# EAGLE design power supply bot (EAGLE 9.6.2)
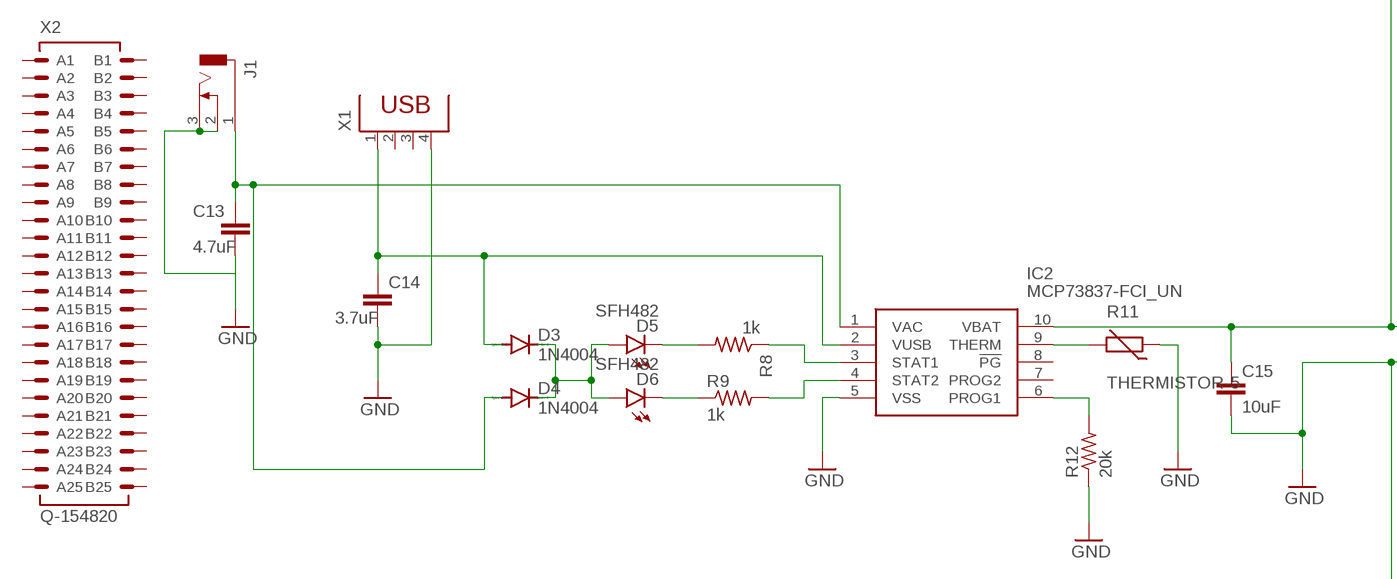
[diagram p0: schematic, sheet 1, part 1 of 2]
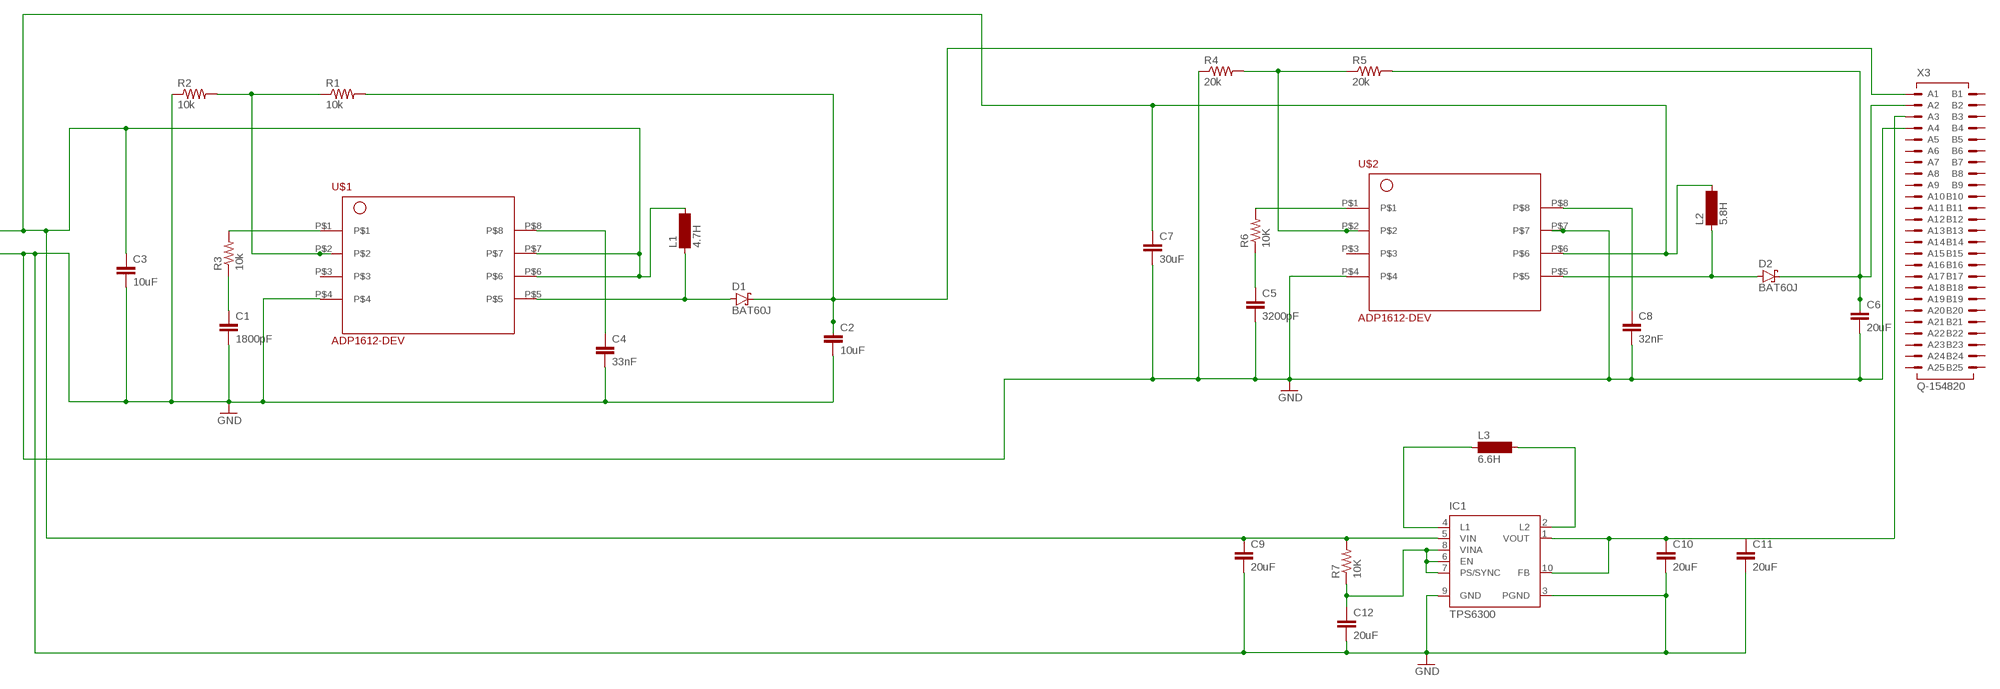
[diagram p1: schematic, sheet 1, part 2 of 2]

## Parts
C1  1800pF  C2.5/4  [C2.5-4]
C2  10uF  C2.5/4  [C2.5-4]
C3  10uF  C2.5/4  [C2.5-4]
C4  33nF  C2.5/4  [C2.5-4]
C5  3200pF  C2.5/4  [C2.5-4]
C6  20uF  C2.5/4  [C2.5-4]
C7  30uF  C2.5/4  [C2.5-4]
C8  32nF  C2.5/4  [C2.5-4]
C9  20uF  C2,5-3  [C2.5-3]
C10  20uF  C2,5-3  [C2.5-3]
C11  20uF  C2,5-3  [C2.5-3]
C12  20uF  C2,5-3  [C2.5-3]
C13  4.7uF  C2,5-3  [C2.5-3]
C14  3.7uF  C2,5-3  [C2.5-3]
C15  10uF  C2,5-3  [C2.5-3]
D1  BAT60J  [SOD323_ST]
D2  BAT60J  [SOD323_ST]
D3  1N4004  [DO41-10]
D4  1N4004  [DO41-10]
D5  SFH482  [SFH482]
D6  SFH482  [SFH482]
IC1  TPS6300  [DRC-S-PVSON-N10]
IC2  MCP73837-FCI_UN  [SOP50P490X110-10N]
J1  DCJ0303  [DCJ0303]
L1  4.7H  BS11  [BS11]
L2  5.8H  BS11  [BS11]
L3  6.6H  BS75  [BS75]
R1  10k  R-US_0204/7  [0204/7]
R2  10k  R-US_0204/7  [0204/7]
R3  10k  R-US_0204/7  [0204/7]
R4  20k  R-US_0204/7  [0204/7]
R5  20k  R-US_0204/7  [0204/7]
R6  10K  R-US_0204/7  [0204/7]
R7  10K  R-US_0204/5  [0204/5]
R8  1k  R-US_0204/5  [0204/5]
R9  1k  R-US_0204/5  [0204/5]
R11  THERMISTOR-5  [R-5]
R12  20k  R-US_0204/5  [0204/5]
U$1  ADP1612-DEV  [TQFP-ADP1612]
U$2  ADP1612-DEV  [TQFP-ADP1612]
X1  PN61729  [PN61729]
X2  Q-154820  [154820]
X3  Q-154820  [154820]

## Nets
GND: C1.2 C2.2 C3.2 C4.2 C5.2 C6.2 C7.2 C8.2 C9.2 C10.2 C11.2 C12.2 C13.2 C14.1 C14.2 C15.2 D3.A IC1.3(PGND) IC1.9(GND) IC2.2(VUSB) IC2.5(VSS) J1.2 J1.3 R2.1 R4.1 R11.1 R12.1 U$1.P$4 U$2.P$4 U$2.P$7 X1.1 X1.4 X3.A4
N$1: R3.2 U$1.P$1
N$2: C1.1 R3.1
N$3: R1.1 R2.2 U$1.P$2
N$4: C2.1 D1.C R1.2 X3.A1
N$5: D1.A L1.1 U$1.P$5
N$6: C4.1 U$1.P$8
N$8: C3.1 C7.1 C9.1 C15.1 IC1.5(VIN) IC2.10(VBAT) L1.2 L2.2 R7.2 U$1.P$6 U$1.P$7 U$2.P$6
N$9: R6.2 U$2.P$1
N$10: C5.1 R6.1
N$11: R4.2 R5.1 U$2.P$2
N$12: C6.1 D2.C R5.2 X3.A2
N$13: C8.1 U$2.P$8
N$14: D2.A L2.1 U$2.P$5
N$16: IC1.4(L1) L3.1
N$17: IC1.2(L2) L3.2
N$18: C10.1 C11.1 IC1.1(VOUT) IC1.10(FB) X3.A3
N$19: IC2.9(THERM) R11.2
N$20: C12.1 IC1.6(EN) IC1.7(PS/SYNC) IC1.8(VINA) R7.1
N$21: IC2.6(PROG1) R12.2
N$22: D5.K(C) R8.2
N$23: D6.K(C) R9.1
N$24: C13.1 D4.A IC2.1(VAC) J1.1
N$25: IC2.3(STAT1) R8.1
N$26: IC2.4(STAT2) R9.2
N$28: D3.C D4.C D5.A D6.A
Unconnected: IC1.TH IC2.7(PROG2) IC2.8(!PG) U$1.P$3 U$2.P$3 X1.2 X1.3 X2.A1 X2.A2 X2.A3 X2.A4 X2.A5 X2.A6 X2.A7 X2.A8 X2.A9 X2.A10 X2.A11 X2.A12 X2.A13 X2.A14 X2.A15 X2.A16 X2.A17 X2.A18 X2.A19 X2.A20 X2.A21 X2.A22 X2.A23 X2.A24 X2.A25 X2.B1 X2.B2 X2.B3 X2.B4 X2.B5 X2.B6 X2.B7 X2.B8 X2.B9 X2.B10 X2.B11 X2.B12 X2.B13 X2.B14 X2.B15 X2.B16 X2.B17 X2.B18 X2.B19 X2.B20 X2.B21 X2.B22 X2.B23 X2.B24 X2.B25 X3.A5 X3.A6 X3.A7 X3.A8 X3.A9 X3.A10 X3.A11 X3.A12 X3.A13 X3.A14 X3.A15 X3.A16 X3.A17 X3.A18 X3.A19 X3.A20 X3.A21 X3.A22 X3.A23 X3.A24 X3.A25 X3.B1 X3.B2 X3.B3 X3.B4 X3.B5 X3.B6 X3.B7 X3.B8 X3.B9 X3.B10 X3.B11 X3.B12 X3.B13 X3.B14 X3.B15 X3.B16 X3.B17 X3.B18 X3.B19 X3.B20 X3.B21 X3.B22 X3.B23 X3.B24 X3.B25

## Library data of the parts
C1-C15 = capacitor-wima:C: CAPACITOR naming: grid - package width
D1 D2 = diode:BAT60J: Schottky barrier diode Source: www.st.com, BAT60J.pdf
D3 D4 = diode:1N4004: DIODE general purpose rectifier, 1 A
D5 D6 = led:SFH482: IR LED infrared emitting diode, Infineon
IC1 = texas:TPS6300*: HIGH EFFICIENT SINGLE INDUCTOR BUCK-BOOST CONVERTER WITH 1.8-A SWITCHES Source: http://focus.ti.com/lit/ds/symlink/tps63001.pdf; MPN: TPS63000DRCTG4; OC_FARNELL: 1511852; OC_NEWARK: 59M7217
IC2 = MCP73837-FCI_UN:MCP73837-FCI_UN: Li-Ion Charger USB/DC 4.2V 1A PG MSOP10 Source: Datasheet <http://ww1.microchip.com/downloads/en/DeviceDoc/22071B.pdf>; ARROW_PART_NUMBER: MCP73837-FCI/UN; ARROW_PRICE-STOCK: https://www.arrow.com/en/products/mcp73837-fciun/microchip-technology; DESCRIPTION: Li-Ion Charger USB/DC 4.2V 1A PG MSOP10; HEIGHT: 1.1mm; MANUFACTURER_NAME: Microchip; MANUFACTURER_PART_NUMBER: MCP73837-FCI/UN; MOUSER_PART_NUMBER: 579-MCP73837-FCI/UN; MOUSER_PRICE-STOCK: https://www.mouser.co.uk/ProductDetail/Microchip-Technology/MCP73837-FCI-UN?qs=hH%252BOa0VZEiDKGj395FRsiw%3D%3D
J1 = con-jack:DCJ0303: DC POWER JACK Source: DCJ0303.pdf; OC_FARNELL: unknown; OC_NEWARK: unknown
L1-L3 = inductor-neosid:BS: INDUCTOR nominal inductance, magnetically screened; OC_FARNELL: unknown; OC_NEWARK: unknown
R1-R9 R12 = rcl:R-US_: RESISTOR, American symbol; SPICEPREFIX: R
R11 = varistor:THERMISTOR: THERMISTOR
U$1 U$2 = ADP1612:ADP1612-DEV
X1 = con-berg:PN61729: BERG USB connector; OC_FARNELL: unknown; OC_NEWARK: unknown
X2 X3 = con-erni:Q-154820: Male Connector SMC-Q 50 contacts Type 7-13 - Low Profile Source: http://www.erni.com/DB/PDF-Drawing/SMC/154820.pdf; OC_FARNELL: unknown; OC_NEWARK: unknown

## Board
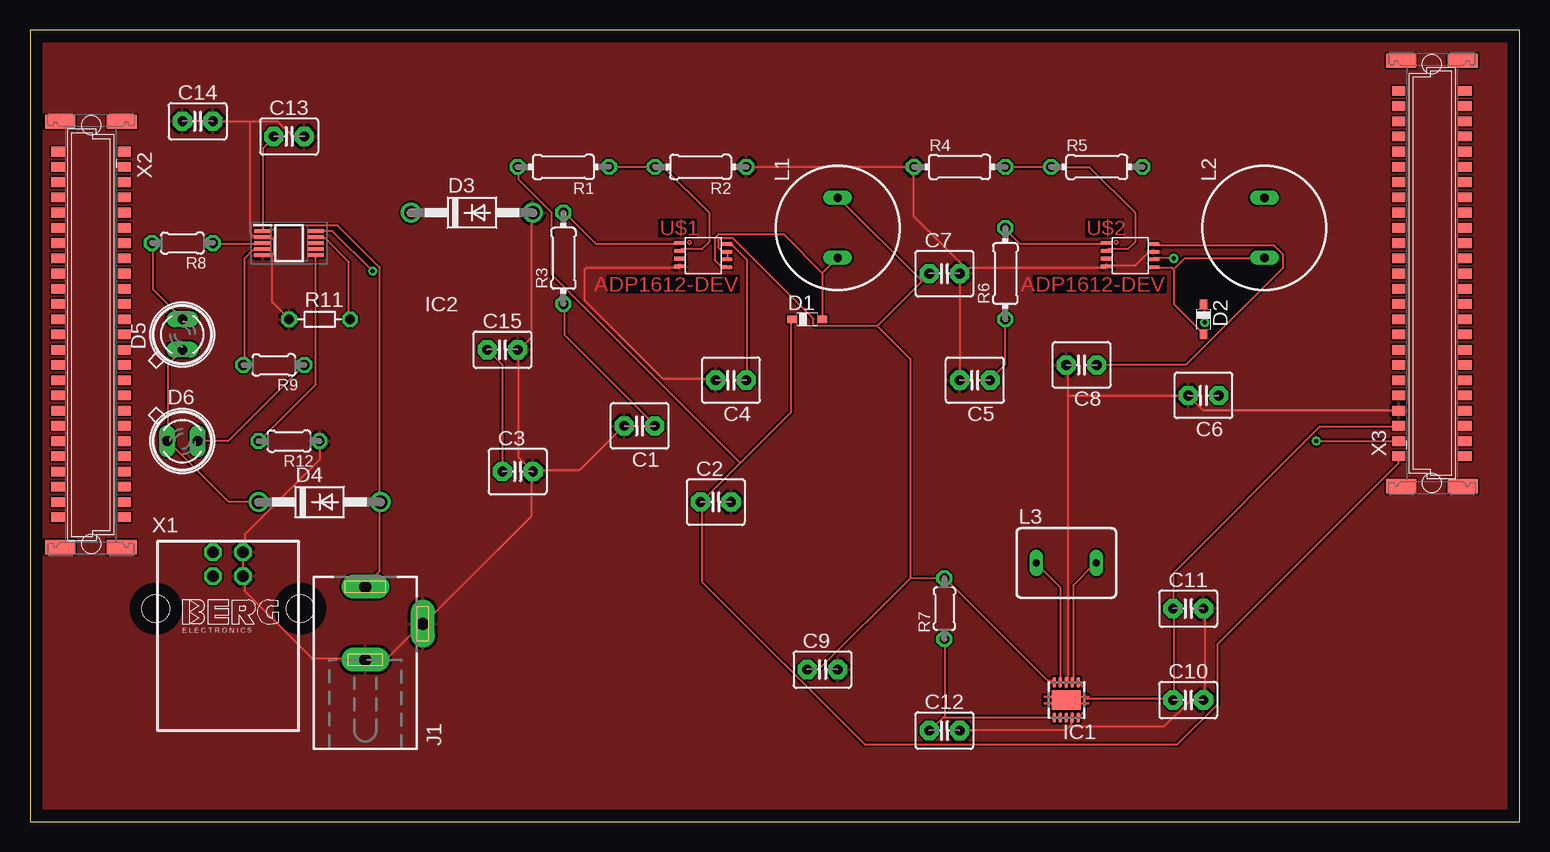
[diagram p2: board, top side]
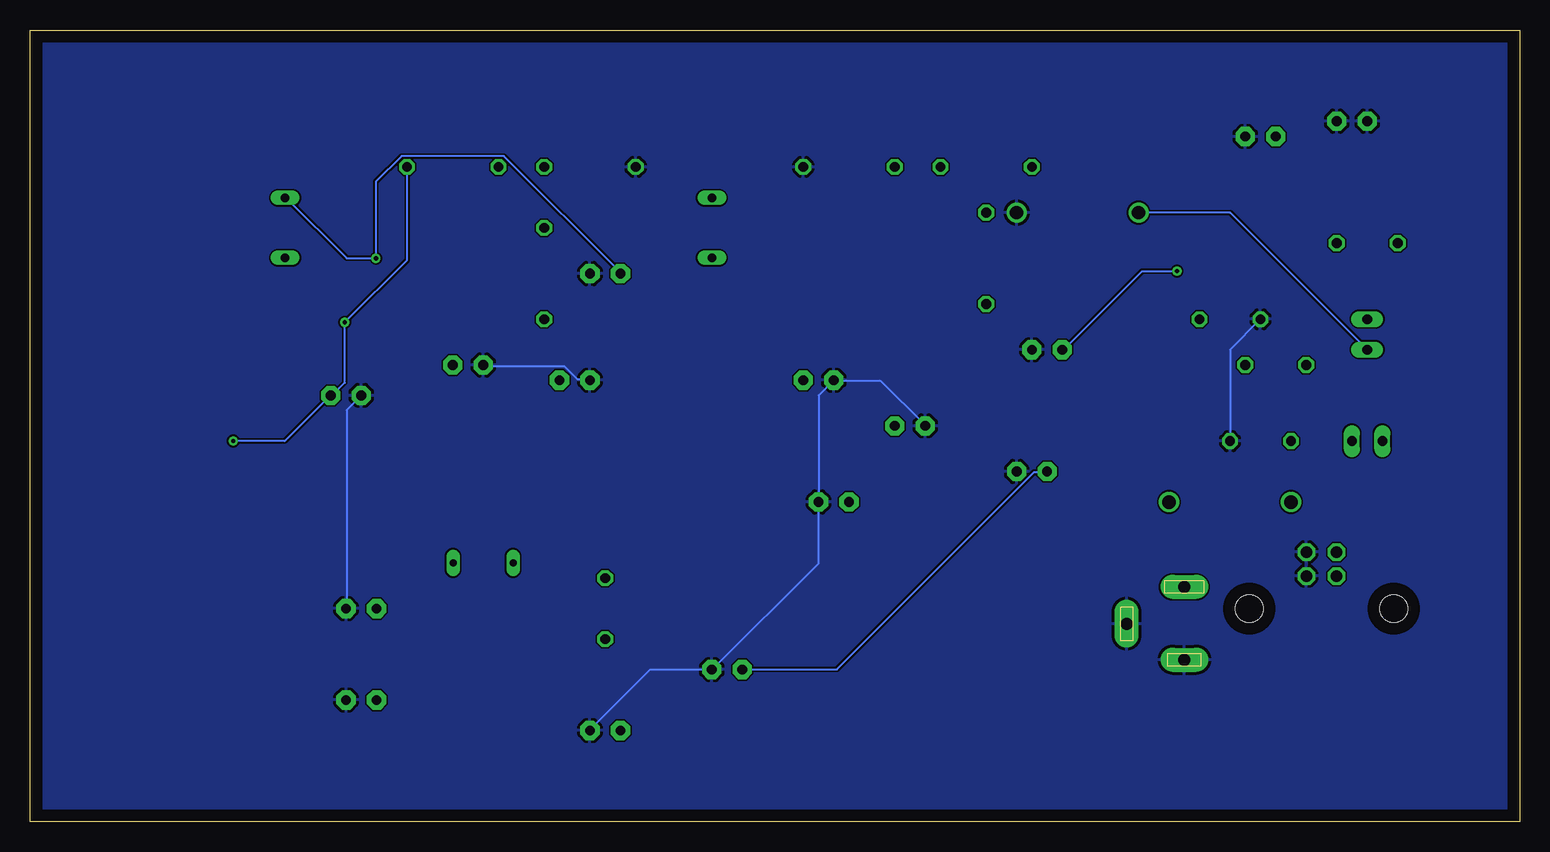
[diagram p3: board, bottom side, seen from below]

Size 124.13 x 66.03 mm. Coordinates in mm from the lower left corner, seen from the top.
Outline: 0,0 124.13,0 124.13,66.03 0,66.03 0,0
Copper layers (1*16): Top 0.035mm / dielectric 1.5mm / Bottom 0.035mm
Design rules "default": minimum track width 6mil, minimum drill 0.35mm, track to track 6mil, track to pad 6mil, pad to pad 6mil, via to via 6mil, smd to smd 6mil, copper to edge 40mil, drill to drill 6mil, minimum pad ring 10mil, minimum via ring 8mil, stop-mask expansion 4mil, vias tented up to drill 0mil, thermal gap 10mil

### Footprints (pad centres in the part's own frame; a part is rotated, then mirrored left to right if it is on the bottom)
C2.5-4 = drill 0.813 pad 1.6 octagon: 1 -1.27,0; 2 1.27,0
C2.5-3 = drill 0.813 pad 1.6 octagon: 1 -1.27,0; 2 1.27,0
SOD323_ST = smd 0.8 x 0.6: A 1.25,0; C -1.25,0
DO41-10 = drill 1.118: A 5.08,0; C -5.08,0
SFH482 = drill 0.813 long: A -1.27,0; K 1.27,0
DRC-S-PVSON-N10 = smd 0.28 x 0.85: 1 -1,-1.475; 2 -0.5,-1.475; 3 0,-1.475; 4 0.5,-1.475; 5 1,-1.475; 6 1,1.475; 7 0.5,1.475; 8 0,1.475; 9 -0.5,1.475; 10 -1,1.475 | smd 2.4 x 1.65: TH 0,0
SOP50P490X110-10N = smd 1.4 x 0.3: 1 -2.2,1; 2 -2.2,0.5; 3 -2.2,0; 4 -2.2,-0.5; 5 -2.2,-1; 6 2.2,-1; 7 2.2,-0.5; 8 2.2,0; 9 2.2,0.5; 10 2.2,1
DCJ0303 = drill 1 pad 2 long: 1 0,3.1; 2 4.8,0; 3 0,-3
BS11 = drill 0.7 long: 1 -2.5,0; 2 2.5,0
BS75 = drill 0.6 long: 1 -2.5,0; 2 2.5,0
0204/7 = drill 0.813 octagon: 1 -3.81,0; 2 3.81,0
0204/5 = drill 0.813 octagon: 1 -2.54,0; 2 2.54,0
R-5 = drill 0.813 octagon: 1 -2.54,0; 2 2.54,0
TQFP-ADP1612 = smd 0.95 x 0.3: P$1 -0.45,2.55; P$2 -0.45,1.9; P$3 -0.45,1.25; P$4 -0.45,0.6; P$5 3.45,0.525; P$6 3.45,1.175; P$7 3.45,1.825; P$8 3.45,2.475
PN61729 = drill 0.95 octagon: 1 1.25,4.71; 2 -1.25,4.71; 3 -1.25,2.71; 4 1.25,2.71 | hole 2.3: -6.02,0; 6.02,0
154820 = smd 0.8 x 1.1: A1 -15.24,2.765; A2 -13.97,2.765; A3 -12.7,2.765; A4 -11.43,2.765; A5 -10.16,2.765; A6 -8.89,2.765; A7 -7.62,2.765; A8 -6.35,2.765; A9 -5.08,2.765; A10 -3.81,2.765; A11 -2.54,2.765; A12 -1.27,2.765; A13 0,2.765; A14 1.27,2.765; A15 2.54,2.765; A16 3.81,2.765; A17 5.08,2.765; A18 6.35,2.765; A19 7.62,2.765; A20 8.89,2.765; A21 10.16,2.765; A22 11.43,2.765; A23 12.7,2.765; A24 13.97,2.765; A25 15.24,2.765; B1 -15.24,-2.74; B2 -13.97,-2.74; B3 -12.7,-2.74; B4 -11.43,-2.74; B5 -10.16,-2.74; B6 -8.89,-2.74; B7 -7.62,-2.74; B8 -6.35,-2.74; B9 -5.08,-2.74; B10 -3.81,-2.74; B11 -2.54,-2.74; B12 -1.27,-2.74; B13 0,-2.74; B14 1.27,-2.74; B15 2.54,-2.74; B16 3.81,-2.74; B17 5.08,-2.74; B18 6.35,-2.74; B19 7.62,-2.74; B20 8.89,-2.74; B21 10.16,-2.74; B22 11.43,-2.74; B23 12.7,-2.74; B24 13.97,-2.74; B25 15.24,-2.74 | smd 1.2 x 2.5: M1 -17.745,2.55; M2 -17.745,-2.55; M3 17.745,-2.55; M4 17.745,2.55

### Placement (x,y rotation side)
C1  50.8,33.02 180 top
C2  57.15,26.67 0 top
C3  40.64,29.21 0 top
C4  58.42,36.83 180 top
C5  78.74,36.83 180 top
C6  97.79,35.56 180 top
C7  76.2,45.72 0 top
C8  87.63,38.1 180 top
C9  66.04,12.7 0 top
C10  96.52,10.16 0 top
C11  96.52,17.78 0 top
C12  76.2,7.62 0 top
C13  21.59,57.15 0 top
C14  13.97,58.42 0 top
C15  39.37,39.37 0 top
D1  64.77,41.91 0 top
D2  97.79,41.91 270 top
D3  36.83,50.8 0 top
D4  24.13,26.67 0 top
D5  12.7,40.64 90 top
D6  12.7,31.75 0 top
IC1  86.36,10.16 180 top
IC2  21.59,48.26 0 top
J1  27.94,16.51 0 top
L1  67.31,49.53 90 top
L2  102.87,49.53 90 top
L3  86.36,21.59 0 top
R1  44.45,54.61 180 top
R2  55.88,54.61 180 top
R3  44.45,46.99 90 top
R4  77.47,54.61 0 top
R5  88.9,54.61 0 top
R6  81.28,45.72 90 top
R7  76.2,17.78 90 top
R8  12.7,48.26 180 top
R9  20.32,38.1 180 top
R11  24.13,41.91 0 top
R12  21.59,31.75 180 top
U$1  54.61,45.72 0 top
U$2  90.17,45.72 0 top
X1  16.51,17.78 0 top
X2  5.08,40.64 270 top
X3  116.84,45.72 90 top

### Tracks (layer width: path | path; a pad name or v marks a point on that pad's centre or on a via)
GND
  Top 0.152: U$1.P$4 54.15,46.23 46.38,46.23 46.23,46.08 46.23,43.48 52.78,36.93 57.05,36.93 C4.2 | C3.2 41.96,29.31 45.77,29.31 49.43,32.97 C1.2 | 40.74,39.37 40.74,30.38 C3.2 | 40.74,39.37 41.81,40.44 41.81,50.8 D3.A | 40.74,39.37 C15.2 | C14.1 C14.2 18.34,58.42 | 18.34,58.42 20.62,58.42 21.84,57.2 22.76,57.2 C13.2 | 27.94,13.61 29.77,13.61 32.66,16.51 J1.2 32.82,16.51 41.81,25.5 41.81,29.16 C3.2 | 20.17,47.3 19.41,47.3 IC2.5 | 20.17,47.3 20.32,47.45 20.32,48.51 20.17,48.67 19.41,48.67 IC2.2 19.25,48.82 18.64,48.82 18.34,49.12 18.34,58.42 | 20.17,47.3 20.17,43.33 R11.1 | R12.1 24.13,30.23 17.88,23.98 17.88,22.61 X1.1 17.73,22.45 17.73,20.62 X1.4 17.88,20.47 17.88,19.25 23.52,13.61 27.94,13.61 | 27.94,13.61 J1.3 | R2.1 R4.1 73.66,50.49 77.93,46.23 | U$2.P$7 93.47,47.45 93.17,47.45 92.1,46.38 89.81,46.38 U$2.P$4 89.66,46.23 77.93,46.23 | 77.93,46.23 77.47,45.77 C7.2 | C7.2 C5.2 | 77.93,46.23 C7.2 | C11.2 97.89,17.73 97.89,10.26 C10.2 97.74,10.11 96.67,10.11 94.54,7.98 86.61,7.98 | 86.61,7.98 86.31,7.67 77.47,7.67 C12.2 | 86.61,7.98 86.77,8.13 86.77,8.59 IC1.9 | X3.A4 114.05,34.34 97.74,34.34 C6.2 86.46,35.56 | 86.46,35.56 86.46,38 C8.2 | 86.46,35.56 86.46,11.79 IC1.3
  Bottom 0.152: C1.2 49.58,33.12 53.24,36.78 57.05,36.78 C4.2 58.42,35.56 C2.2 58.42,21.54 67.26,12.7 C9.2 72.44,12.7 77.47,7.67 C12.2 | R12.1 24.13,39.37 R11.1 | C6.2 97.74,34.34 97.74,17.88 C11.2 | C5.2 77.47,36.93 78.54,36.93 79.6,38 86.31,38 C8.2
  pour Top: -2.54,69.85 -2.54,-1.27 127,-1.27 127,69.85
  pour Bottom: -5.08,72.39 129.54,72.39 129.54,-3.81 -5.08,-3.81
N$1
  Top 0.152: U$1.P$1 54.15,48.21 47.14,48.21 44.55,50.8 R3.2
N$2
  Top 0.152: R3.1 44.55,43.18 44.55,40.59 52.02,33.12 C1.1
N$3
  Top 0.152: U$1.P$2 54.3,47.75 55.98,47.75 56.59,48.36 56.59,50.8 52.78,54.61 R2.2 R1.1
N$4
  Top 0.152: 59.18,29.92 55.98,26.72 C2.1 55.98,26.57 55.98,20.02 69.55,6.45 95.61,6.45 98.96,9.8 98.96,14.83 114.05,29.92 114.05,30.38 X3.A1 | 59.18,29.92 63.45,34.19 63.45,41.81 D1.C | 59.18,29.92 43.49,45.62 43.49,50.8 40.74,53.54 40.74,54.61 R1.2
N$5
  Top 0.152: 66.04,45.77 66.04,41.96 D1.A | 66.04,45.77 67.26,46.99 L1.1 | 66.04,45.77 62.84,48.97 57.35,48.97 57.05,48.67 57.05,46.84 57.51,46.38 57.96,46.38 U$1.P$5
N$6
  Top 0.152: U$1.P$8 58.12,48.06 58.57,48.06 59.79,46.84 59.79,36.93 C4.1
N$8  (via drill 0.35)
  Top 0.152: v28.55,45.92 25.2,49.28 23.82,49.28 IC2.10 | C3.1 39.37,38.15 38.15,39.37 C15.1 | IC1.5 85.24,11.79 84.78,11.79 76.25,20.32 R7.2 73.35,20.32 | C9.1 65.73,12.7 73.35,20.32 | v95.3,46.99 93.62,46.99 U$2.P$6 | U$1.P$6 58.12,46.99 58.12,47.45 U$1.P$7 57.96,47.6 57.66,47.6 57.35,47.9 57.35,48.51 57.51,48.67 58.57,48.67 65.28,41.96 65.28,41.5 65.43,41.35 70.61,41.35 | 74.42,45.16 74.88,45.62 C7.1 74.42,45.16 | 74.42,45.16 70.61,41.35 | 74.42,45.16 74.27,45.16 67.41,52.02 L1.2 | 73.35,20.32 73.35,38.61 70.61,41.35
  Bottom 0.152: v28.55,45.92 31.45,45.92 38,39.37 C15.1 | L2.2 102.77,52.02 97.74,46.99 v95.3,46.99 95.3,53.39 93.17,55.52 84.63,55.52 74.88,45.77 C7.1 | C9.1 56.9,12.7 40.44,29.16 39.37,29.16 C3.1
N$9
  Top 0.152: U$2.P$1 89.66,48.21 82.5,48.21 81.28,49.43 R6.2
N$10
  Top 0.152: R6.1 81.28,38.15 80.06,36.93 C5.1
N$11
  Top 0.152: U$2.P$2 89.81,47.75 91.49,47.75 92.1,48.36 92.1,50.8 88.29,54.61 R5.1 R4.2
N$12  (via drill 0.35)
  Top 0.152: v97.89,41.66 97.89,43.03 D2.C | v107.19,31.75 X3.A2
  Bottom 0.152: v107.19,31.75 102.92,31.75 99.11,35.56 C6.1 98.96,35.56 97.89,36.63 v97.89,41.66 92.71,46.84 R5.2
N$13
  Top 0.152: U$2.P$8 93.62,48.06 103.68,48.06 104.44,47.3 104.44,46.23 96.37,38.15 88.9,38.15 C8.1
N$14
  Top 0.152: 95.3,46.08 95.3,43.18 97.74,40.74 D2.A | 95.3,46.08 95.15,46.23 93.62,46.23 U$2.P$5 | 95.3,46.08 96.21,46.99 102.77,46.99 L2.1
N$16
  Top 0.152: IC1.4 85.85,11.79 85.85,19.56 83.87,21.54 L3.1
N$17
  Top 0.152: IC1.2 86.92,11.79 86.92,19.71 88.75,21.54 L3.2
N$18
  Top 0.152: 87.83,10.26 87.83,11.18 87.38,11.63 IC1.1 | 87.83,10.26 87.83,9.2 87.38,8.74 IC1.10 | 87.83,10.26 95.15,10.26 C10.1 95.3,10.26 95.3,17.73 C11.1 95.3,17.88 95.3,20.78 107.49,32.97 114.05,32.97 X3.A3
N$19
  Top 0.152: IC2.9 23.82,48.67 24.59,48.67 26.57,46.69 26.57,41.96 R11.2
N$20
  Top 0.152: 85.85,8.74 85.39,8.74 IC1.6 85.24,8.74 76.25,8.74 | 85.85,8.74 86.31,8.74 IC1.8 | 85.85,8.74 IC1.7 | 76.25,8.74 76.1,8.74 75.03,7.67 C12.1 | 76.25,8.74 76.25,15.14 R7.1
N$21
  Top 0.152: IC2.6 23.82,47.14 23.82,36.47 19.1,31.75 R12.2
N$22
  Top 0.152: R8.2 10.26,48.21 10.26,44.4 12.7,41.96 D5.K
N$23
  Top 0.152: D6.K 16.51,31.75 R9.1
N$24
  Top 0.152: 19.41,49.73 19.41,56.13 20.32,57.05 C13.1 | 19.41,49.73 19.41,49.28 IC2.1 | J1.1 27.94,19.71 29.16,20.93 29.16,26.57 D4.A 29.16,26.72 29.16,46.23 25.65,49.73 19.41,49.73
N$25
  Top 0.152: IC2.3 19.25,48.21 15.29,48.21 R8.1
N$26
  Top 0.152: IC2.4 19.25,47.75 18.64,47.75 17.88,46.99 17.88,38.15 R9.2
N$28
  Top 0.152: 11.48,31.75 11.48,38.15 D5.A | 11.48,31.75 16.51,26.72 18.95,26.72 D4.C | 11.48,31.75 D6.A
  Bottom 0.152: D3.C 24.13,50.8 D5.A